# EAGLE design ds32 (EAGLE 6.6.0)
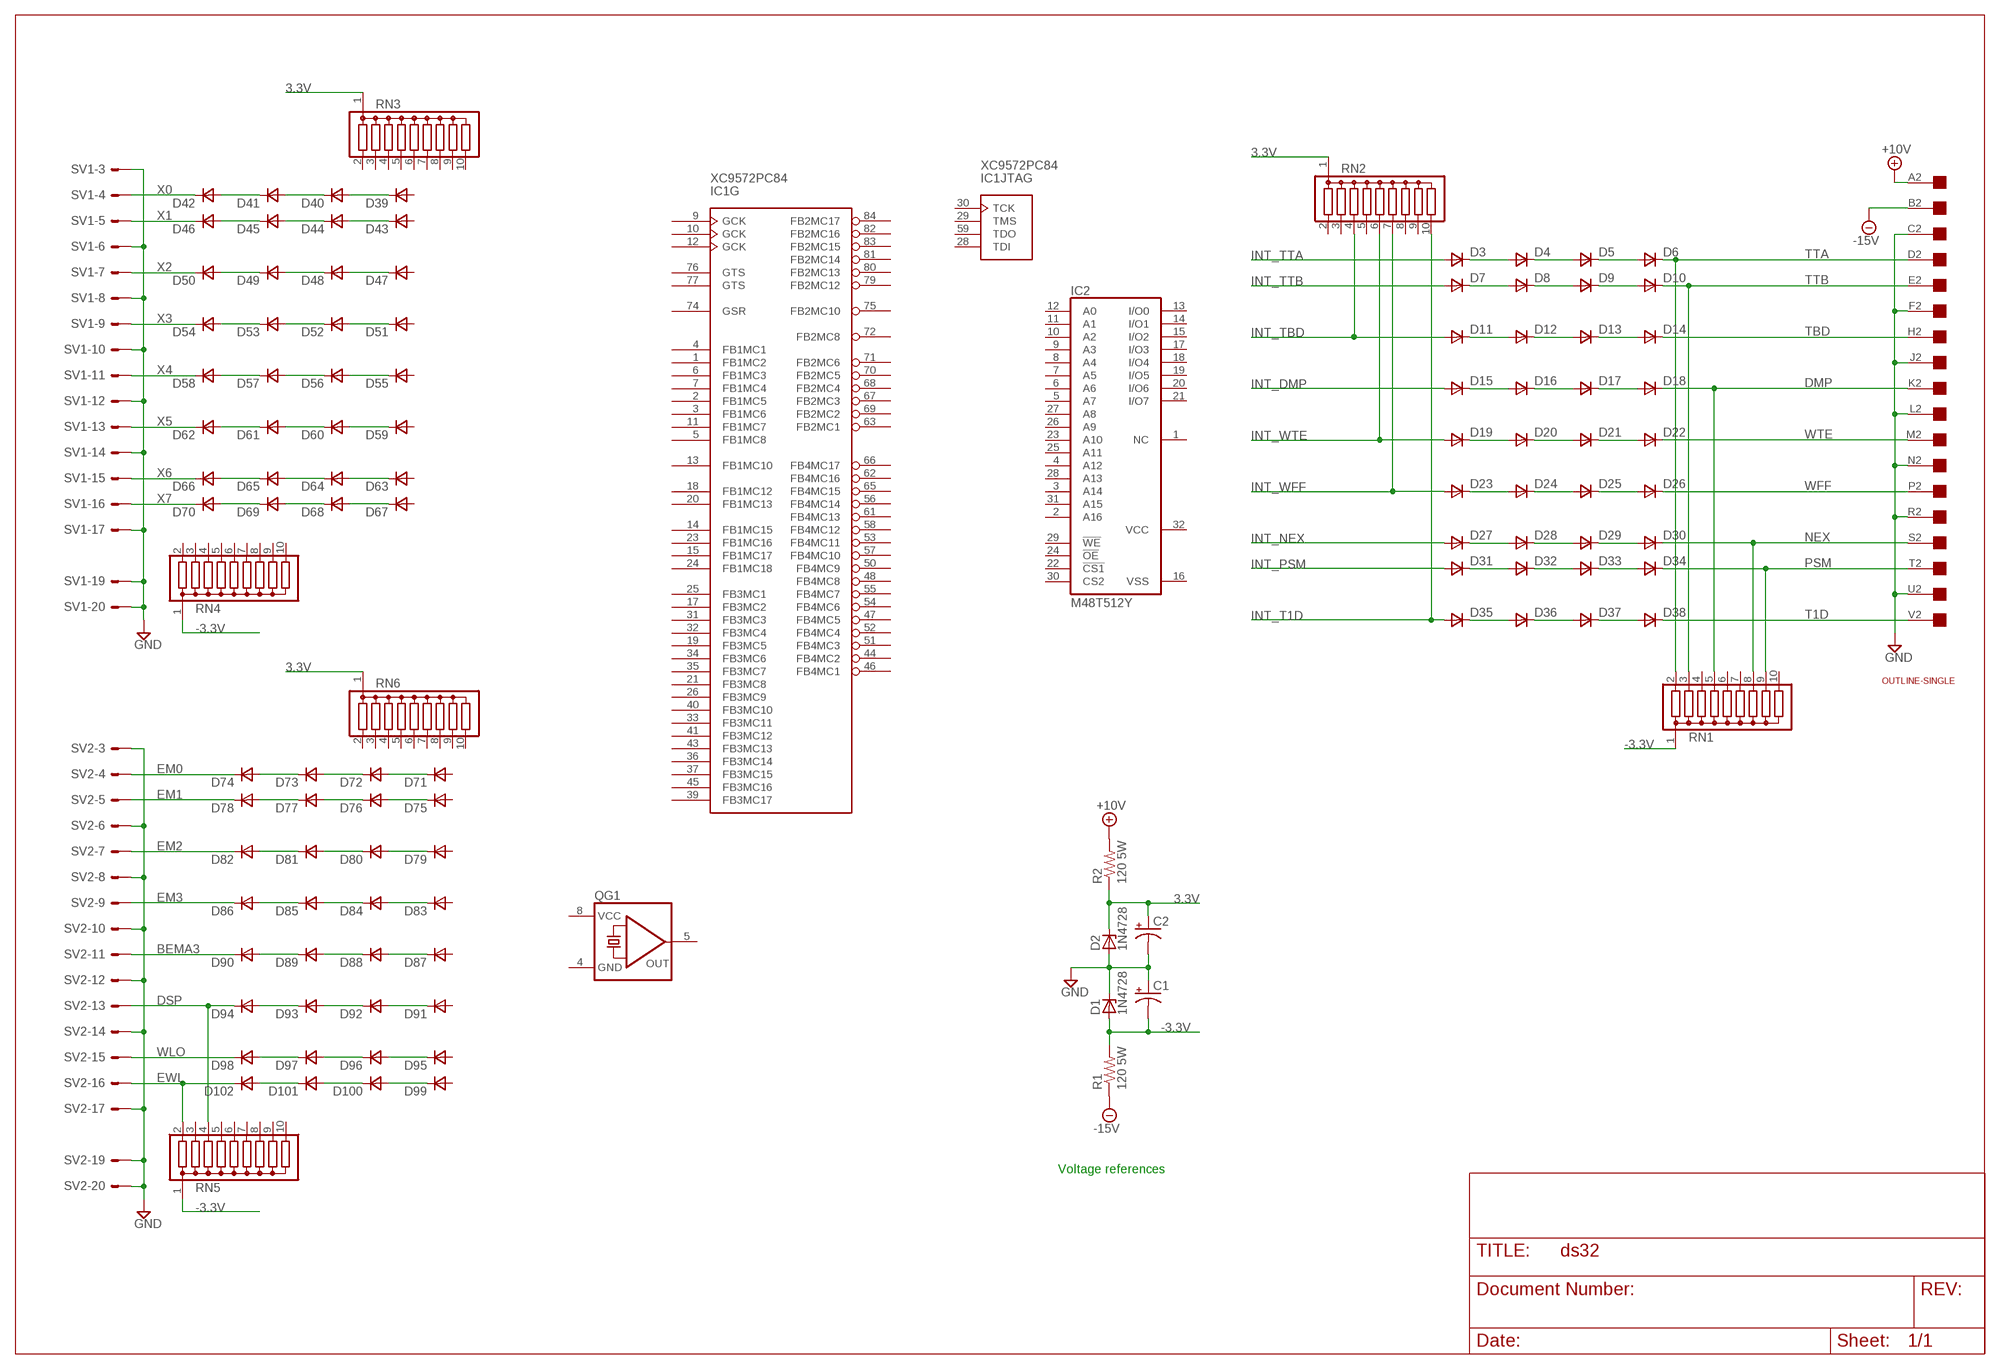
[diagram p0: schematic, sheet 1]

## Parts
C1  CPOL-USE15-5AXIAL  [E15-5]
C2  CPOL-USE15-5AXIAL  [E15-5]
D1  1N4728  [DO41Z10]
D2  1N4728  [DO41Z10]
D3  DSOD323  [SOD323]
D4  DSOD323  [SOD323]
D5  DSOD323  [SOD323]
D6  DSOD323  [SOD323]
D7  DSOD323  [SOD323]
D8  DSOD323  [SOD323]
D9  DSOD323  [SOD323]
D10  DSOD323  [SOD323]
D11  DSOD323  [SOD323]
D12  DSOD323  [SOD323]
D13  DSOD323  [SOD323]
D14  DSOD323  [SOD323]
D15  DSOD323  [SOD323]
D16  DSOD323  [SOD323]
D17  DSOD323  [SOD323]
D18  DSOD323  [SOD323]
D19  DSOD323  [SOD323]
D20  DSOD323  [SOD323]
D21  DSOD323  [SOD323]
D22  DSOD323  [SOD323]
D23  DSOD323  [SOD323]
D24  DSOD323  [SOD323]
D25  DSOD323  [SOD323]
D26  DSOD323  [SOD323]
D27  DSOD323  [SOD323]
D28  DSOD323  [SOD323]
D29  DSOD323  [SOD323]
D30  DSOD323  [SOD323]
D31  DSOD323  [SOD323]
D32  DSOD323  [SOD323]
D33  DSOD323  [SOD323]
D34  DSOD323  [SOD323]
D35  DSOD323  [SOD323]
D36  DSOD323  [SOD323]
D37  DSOD323  [SOD323]
D38  DSOD323  [SOD323]
D39  DSOD323  [SOD323]
D40  DSOD323  [SOD323]
D41  DSOD323  [SOD323]
D42  DSOD323  [SOD323]
D43  DSOD323  [SOD323]
D44  DSOD323  [SOD323]
D45  DSOD323  [SOD323]
D46  DSOD323  [SOD323]
D47  DSOD323  [SOD323]
D48  DSOD323  [SOD323]
D49  DSOD323  [SOD323]
D50  DSOD323  [SOD323]
D51  DSOD323  [SOD323]
D52  DSOD323  [SOD323]
D53  DSOD323  [SOD323]
D54  DSOD323  [SOD323]
D55  DSOD323  [SOD323]
D56  DSOD323  [SOD323]
D57  DSOD323  [SOD323]
D58  DSOD323  [SOD323]
D59  DSOD323  [SOD323]
D60  DSOD323  [SOD323]
D61  DSOD323  [SOD323]
D62  DSOD323  [SOD323]
D63  DSOD323  [SOD323]
D64  DSOD323  [SOD323]
D65  DSOD323  [SOD323]
D66  DSOD323  [SOD323]
D67  DSOD323  [SOD323]
D68  DSOD323  [SOD323]
D69  DSOD323  [SOD323]
D70  DSOD323  [SOD323]
D71  DSOD323  [SOD323]
D72  DSOD323  [SOD323]
D73  DSOD323  [SOD323]
D74  DSOD323  [SOD323]
D75  DSOD323  [SOD323]
D76  DSOD323  [SOD323]
D77  DSOD323  [SOD323]
D78  DSOD323  [SOD323]
D79  DSOD323  [SOD323]
D80  DSOD323  [SOD323]
D81  DSOD323  [SOD323]
D82  DSOD323  [SOD323]
D83  DSOD323  [SOD323]
D84  DSOD323  [SOD323]
D85  DSOD323  [SOD323]
D86  DSOD323  [SOD323]
D87  DSOD323  [SOD323]
D88  DSOD323  [SOD323]
D89  DSOD323  [SOD323]
D90  DSOD323  [SOD323]
D91  DSOD323  [SOD323]
D92  DSOD323  [SOD323]
D93  DSOD323  [SOD323]
D94  DSOD323  [SOD323]
D95  DSOD323  [SOD323]
D96  DSOD323  [SOD323]
D97  DSOD323  [SOD323]
D98  DSOD323  [SOD323]
D99  DSOD323  [SOD323]
D100  DSOD323  [SOD323]
D101  DSOD323  [SOD323]
D102  DSOD323  [SOD323]
IC1  XC9572PC84  [PLCC-S84]
IC2  M48T512Y  628128P  [DIL32]
QG1  QG5460  [DIL08S]
R1  120 5W  R-US_0411/15  [0411/15]
R2  120 5W  R-US_0411/15  [0411/15]
RN1  G09R  [SIL10]
RN2  G09R  [SIL10]
RN3  G09R  [SIL10]
RN4  G09R  [SIL10]
RN5  G09R  [SIL10]
RN6  G09R  [SIL10]
SV1  ML20E  [ML20]
SV2  ML20E  [ML20]
U$1  EDGE-1  [EDGE-CON1]
U$2  OUTLINE-SINGLE  [SINGLE]

## Nets
3.3V [power]: C2.+ D2.C R2.1 RN2.1 RN3.1 RN6.1
+10V [power]: R2.2 U$1.A2
-3.3V [power]: C1.- D1.A R1.2 RN1.1 RN4.1 RN5.1
-15V [power]: R1.1 U$1.B2
BEMA3: D90.1(C) SV2.11
DMP: D18.1(C) RN1.5 U$1.K2
DSP: D94.1(C) RN5.4 SV2.13
EM0: D74.1(C) SV2.4
EM1: D78.1(C) SV2.5
EM2: D82.1(C) SV2.7
EM3: D86.1(C) SV2.9
EWL: D102.1(C) RN5.2 SV2.16
GND [power]: C1.+ C2.- D1.C D2.A SV1.3 SV1.6 SV1.8 SV1.10 SV1.12 SV1.14 SV1.17 SV1.19 SV1.20 SV2.3 SV2.6 SV2.8 SV2.10 SV2.12 SV2.14 SV2.17 SV2.19 SV2.20 U$1.C2 U$1.F2 U$1.J2 U$1.L2 U$1.N2 U$1.R2 U$1.U2
INT_DMP: D15.2(A)
INT_NEX: D27.2(A)
INT_PSM: D31.2(A)
INT_T1D: D35.2(A) RN2.10
INT_TBD: D11.2(A) RN2.4
INT_TTA: D3.2(A)
INT_TTB: D7.2(A)
INT_WFF: D23.2(A) RN2.7
INT_WTE: D19.2(A) RN2.6
N$2: D13.1(C) D14.2(A)
N$3: D12.1(C) D13.2(A)
N$4: D11.1(C) D12.2(A)
N$5: D17.1(C) D18.2(A)
N$6: D9.1(C) D10.2(A)
N$7: D8.1(C) D9.2(A)
N$8: D7.1(C) D8.2(A)
N$9: D16.1(C) D17.2(A)
N$10: D15.1(C) D16.2(A)
N$11: D5.1(C) D6.2(A)
N$12: D4.1(C) D5.2(A)
N$13: D3.1(C) D4.2(A)
N$14: D21.1(C) D22.2(A)
N$15: D20.1(C) D21.2(A)
N$16: D19.1(C) D20.2(A)
N$17: D25.1(C) D26.2(A)
N$18: D24.1(C) D25.2(A)
N$19: D23.1(C) D24.2(A)
N$20: D29.1(C) D30.2(A)
N$21: D28.1(C) D29.2(A)
N$22: D27.1(C) D28.2(A)
N$23: D33.1(C) D34.2(A)
N$24: D32.1(C) D33.2(A)
N$25: D31.1(C) D32.2(A)
N$26: D37.1(C) D38.2(A)
N$27: D36.1(C) D37.2(A)
N$28: D35.1(C) D36.2(A)
N$29: D41.1(C) D42.2(A)
N$30: D40.1(C) D41.2(A)
N$31: D39.1(C) D40.2(A)
N$32: D45.1(C) D46.2(A)
N$33: D44.1(C) D45.2(A)
N$34: D43.1(C) D44.2(A)
N$35: D49.1(C) D50.2(A)
N$36: D48.1(C) D49.2(A)
N$37: D47.1(C) D48.2(A)
N$38: D53.1(C) D54.2(A)
N$39: D52.1(C) D53.2(A)
N$40: D51.1(C) D52.2(A)
N$41: D57.1(C) D58.2(A)
N$42: D56.1(C) D57.2(A)
N$43: D55.1(C) D56.2(A)
N$44: D61.1(C) D62.2(A)
N$45: D60.1(C) D61.2(A)
N$46: D59.1(C) D60.2(A)
N$47: D65.1(C) D66.2(A)
N$48: D64.1(C) D65.2(A)
N$49: D63.1(C) D64.2(A)
N$50: D69.1(C) D70.2(A)
N$51: D68.1(C) D69.2(A)
N$52: D67.1(C) D68.2(A)
N$53: D73.1(C) D74.2(A)
N$54: D72.1(C) D73.2(A)
N$55: D71.1(C) D72.2(A)
N$56: D77.1(C) D78.2(A)
N$57: D76.1(C) D77.2(A)
N$58: D75.1(C) D76.2(A)
N$59: D81.1(C) D82.2(A)
N$60: D80.1(C) D81.2(A)
N$61: D79.1(C) D80.2(A)
N$62: D85.1(C) D86.2(A)
N$63: D84.1(C) D85.2(A)
N$64: D83.1(C) D84.2(A)
N$65: D89.1(C) D90.2(A)
N$66: D88.1(C) D89.2(A)
N$67: D87.1(C) D88.2(A)
N$68: D93.1(C) D94.2(A)
N$69: D92.1(C) D93.2(A)
N$70: D91.1(C) D92.2(A)
N$71: D97.1(C) D98.2(A)
N$72: D96.1(C) D97.2(A)
N$73: D95.1(C) D96.2(A)
N$74: D101.1(C) D102.2(A)
N$75: D100.1(C) D101.2(A)
N$76: D99.1(C) D100.2(A)
NEX: D30.1(C) RN1.8 U$1.S2
PSM: D34.1(C) RN1.9 U$1.T2
T1D: D38.1(C) U$1.V2
TBD: D14.1(C) U$1.H2
TTA: D6.1(C) RN1.2 U$1.D2
TTB: D10.1(C) RN1.3 U$1.E2
WFF: D26.1(C) U$1.P2
WLO: D98.1(C) SV2.15
WTE: D22.1(C) U$1.M2
X0: D42.1(C) SV1.4
X1: D46.1(C) SV1.5
X2: D50.1(C) SV1.7
X3: D54.1(C) SV1.9
X4: D58.1(C) SV1.11
X5: D62.1(C) SV1.13
X6: D66.1(C) SV1.15
X7: D70.1(C) SV1.16
Unconnected: D39.2(A) D43.2(A) D47.2(A) D51.2(A) D55.2(A) D59.2(A) D63.2(A) D67.2(A) D71.2(A) D75.2(A) D79.2(A) D83.2(A) D87.2(A) D91.2(A) D95.2(A) D99.2(A) IC1.1(G:FB1MC2) IC1.2(G:FB1MC5) IC1.3(G:FB1MC6) IC1.4(G:FB1MC1) IC1.5(G:FB1MC8) IC1.6(G:FB1MC3) IC1.7(G:FB1MC4) IC1.9(G:GCK) IC1.10(G:GCK) IC1.11(G:FB1MC7) IC1.12(G:GCK) IC1.13(G:FB1MC10) IC1.14(G:FB1MC15) IC1.15(G:FB1MC17) IC1.17(G:FB3MC2) IC1.18(G:FB1MC12) IC1.19(G:FB3MC5) IC1.20(G:FB1MC13) IC1.21(G:FB3MC8) IC1.23(G:FB1MC16) IC1.24(G:FB1MC18) IC1.25(G:FB3MC1) IC1.26(G:FB3MC9) IC1.28(JTAG:TDI) IC1.29(JTAG:TMS) IC1.30(JTAG:TCK) IC1.31(G:FB3MC3) IC1.32(G:FB3MC4) IC1.33(G:FB3MC11) IC1.34(G:FB3MC6) IC1.35(G:FB3MC7) IC1.36(G:FB3MC14) IC1.37(G:FB3MC15) IC1.39(G:FB3MC17) IC1.40(G:FB3MC10) IC1.41(G:FB3MC12) IC1.43(G:FB3MC13) IC1.44(G:FB4MC2) IC1.45(G:FB3MC16) IC1.46(G:FB4MC1) IC1.47(G:FB4MC5) IC1.48(G:FB4MC8) IC1.50(G:FB4MC9) IC1.51(G:FB4MC3) IC1.52(G:FB4MC4) IC1.53(G:FB4MC11) IC1.54(G:FB4MC6) IC1.55(G:FB4MC7) IC1.56(G:FB4MC14) IC1.57(G:FB4MC10) IC1.58(G:FB4MC12) IC1.59(JTAG:TDO) IC1.61(G:FB4MC13) IC1.62(G:FB4MC16) IC1.63(G:FB2MC1) IC1.65(G:FB4MC15) IC1.66(G:FB4MC17) IC1.67(G:FB2MC3) IC1.68(G:FB2MC4) IC1.69(G:FB2MC2) IC1.70(G:FB2MC5) IC1.71(G:FB2MC6) IC1.72(G:FB2MC8) IC1.74(G:GSR) IC1.75(G:FB2MC10) IC1.76(G:GTS) IC1.77(G:GTS) IC1.79(G:FB2MC12) IC1.80(G:FB2MC13) IC1.81(G:FB2MC14) IC1.82(G:FB2MC16) IC1.83(G:FB2MC15) IC1.84(G:FB2MC17) IC2.1(NC) IC2.2(A16) IC2.3(A14) IC2.4(A12) IC2.5(A7) IC2.6(A6) IC2.7(A5) IC2.8(A4) IC2.9(A3) IC2.10(A2) IC2.11(A1) IC2.12(A0) IC2.13(I/O0) IC2.14(I/O1) IC2.15(I/O2) IC2.17(I/O3) IC2.18(I/O4) IC2.19(I/O5) IC2.20(I/O6) IC2.21(I/O7) IC2.22(!CS1) IC2.23(A10) IC2.24(!OE) IC2.25(A11) IC2.26(A9) IC2.27(A8) IC2.28(A13) IC2.29(!WE) IC2.30(CS2) IC2.31(A15) QG1.5(OUT) RN1.4 RN1.6 RN1.7 RN1.10 RN2.2 RN2.3 RN2.5 RN2.8 RN2.9 RN3.2 RN3.3 RN3.4 RN3.5 RN3.6 RN3.7 RN3.8 RN3.9 RN3.10 RN4.2 RN4.3 RN4.4 RN4.5 RN4.6 RN4.7 RN4.8 RN4.9 RN4.10 RN5.3 RN5.5 RN5.6 RN5.7 RN5.8 RN5.9 RN5.10 RN6.2 RN6.3 RN6.4 RN6.5 RN6.6 RN6.7 RN6.8 RN6.9 RN6.10 SV1.1 SV1.2 SV1.18 SV2.1 SV2.2 SV2.18

## Notes on the sheet
- Voltage references

## Power pins joined to a net without a drawn wire
GND: IC1.8(P:GND) IC1.16(P:GND) IC1.27(P:GND) IC1.42(P:GND) IC1.49(P:GND) IC1.60(P:GND) QG1.4(GND)
VCC: IC1.22(P:VCC) IC1.38(P:VCC) IC1.64(P:VCC) IC1.73(P:VCC) IC1.78(P:VCC) IC2.32(VCC) QG1.8(VCC)
VSS: IC2.16(VSS)

## Library data of the parts
C1 C2 = rcl:CPOL-US: POLARIZED CAPACITOR, American symbol
D1 D2 = diode:1N4728: Z DIODE 3.3 V, 1W, 5 percent
D3-D102 = zetex:D: DIODE; MPN: CDSOD323-T05C; OC_FARNELL: 1824860; OC_NEWARK: 79R6078
IC1 = xl_cpld:XC9572PC84
IC2 = memory-hitachi:628128P: MEMORY; OC_FARNELL: unknown; OC_NEWARK: unknown
QG1 = crystal:QG5460: CRYSTAL RESONATOR; OC_FARNELL: unknown; OC_NEWARK: unknown
R1 R2 = rcl:R-US_: RESISTOR, American symbol
RN1-RN6 = resistor-sil:G09R: SIL RESISTOR; OC_FARNELL: unknown; OC_NEWARK: unknown
SV1 SV2 = con-harting-ml:ML20?E: HARTING; OC_FARNELL: unknown; OC_NEWARK: unknown
U$1 = dec-con:EDGE-1: Single-Sided DEC Edge Connector -- (side 2)
U$2 = dec-con:OUTLINE-*: Board outlines for DEC boards.

## Net classes
1 power: width 0.508 mm

## Board
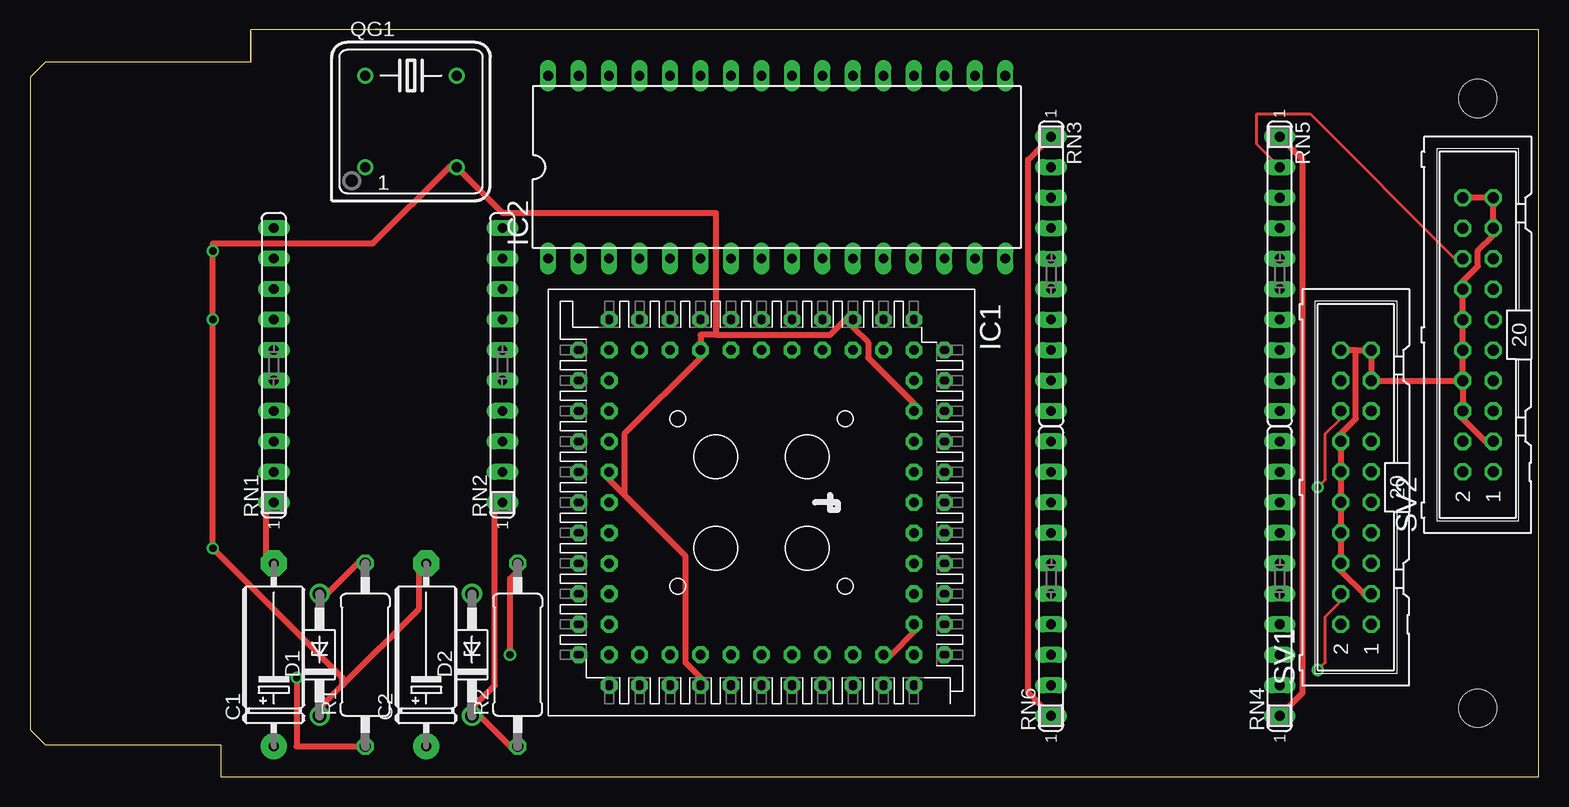
[diagram p1: board, top side]
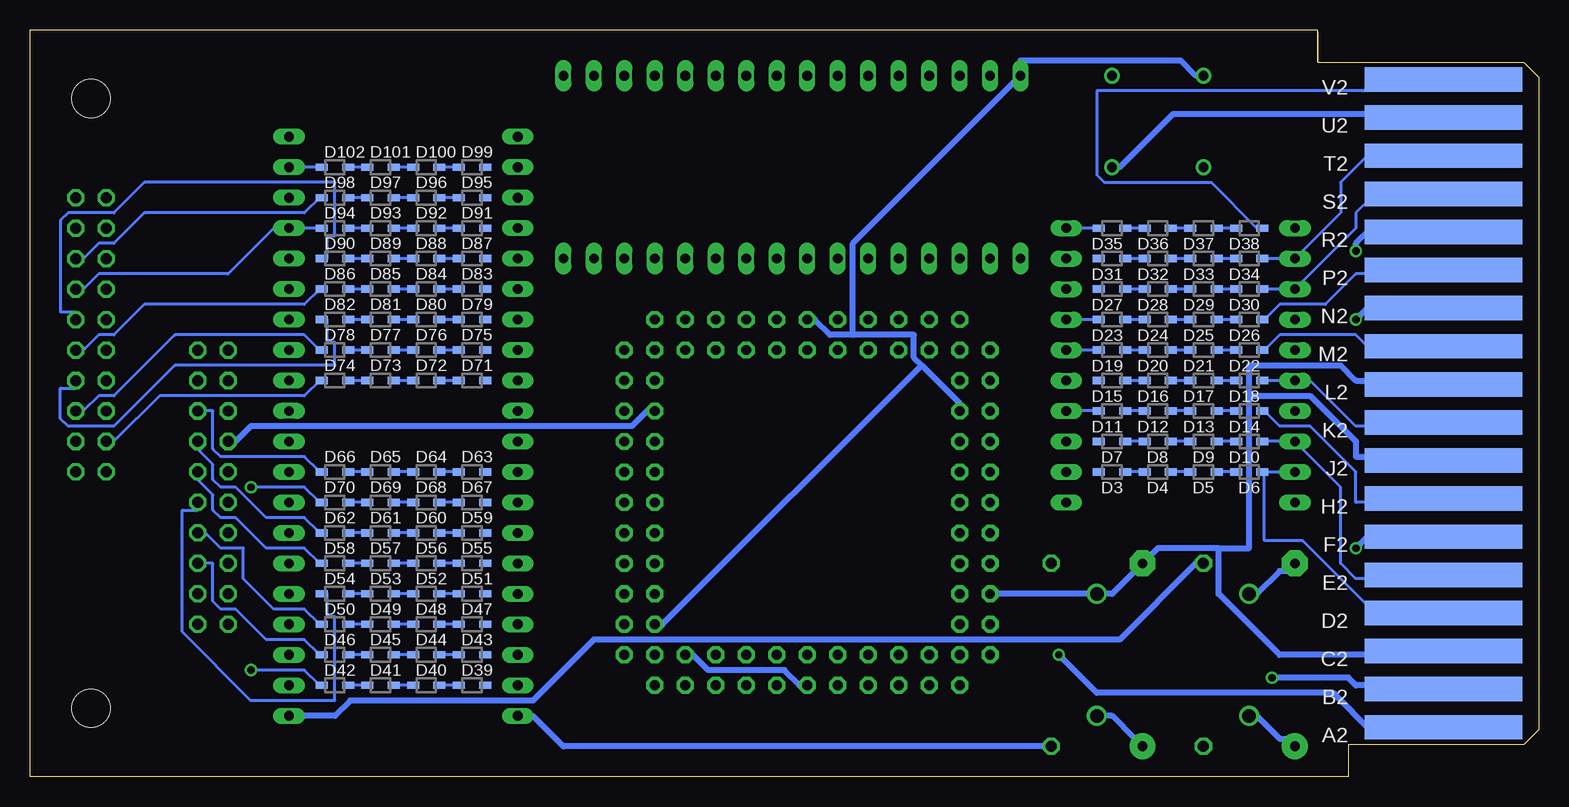
[diagram p2: board, bottom side, seen from below]

Size 125.73 x 62.23 mm. Coordinates in mm from the lower left corner, seen from the top.
Copper layers (1*16): Top 0.035mm / dielectric 1.5mm / Bottom 0.035mm
Design rules "8mils *": minimum track width 10mil, minimum drill 24mil, track to track 8mil, track to pad 8mil, pad to pad 8mil, via to via 8mil, smd to smd 8mil, copper to edge 15mil, drill to drill 10mil, minimum pad ring 10mil, minimum via ring 8mil, stop-mask expansion 0mil, vias tented up to drill 0mil, thermal gap 10mil

### Footprints (pad centres in the part's own frame; a part is rotated, then mirrored left to right if it is on the bottom)
E15-5 = drill 0.813 pad 2.159: + -7.62,0 | drill 0.813 pad 2.159 octagon: - 7.62,0
DO41Z10 = drill 1.118: A 5.08,0; C -5.08,0
SOD323 = smd 1 x 0.6: 1 -1.1,0; 2 1.1,0
PLCC-S84 = drill 0.813 pad 1.397 octagon: 1 0,15.24; 2 0,12.7; 3 -2.54,15.24; 4 -2.54,12.7; 5 -5.08,15.24; 6 -5.08,12.7; 7 -7.62,15.24; 8 -7.62,12.7; 9 -10.16,15.24; 10 -10.16,12.7; 11 -12.7,15.24; 12 -15.24,12.7; 13 -12.7,12.7; 14 -15.24,10.16; 15 -12.7,10.16; 16 -15.24,7.62; 17 -12.7,7.62; 18 -15.24,5.08; 19 -12.7,5.08; 20 -15.24,2.54; 21 -12.7,2.54; 22 -15.24,0; 23 -12.7,0; 24 -15.24,-2.54; 25 -12.7,-2.54; 26 -15.24,-5.08; 27 -12.7,-5.08; 28 -15.24,-7.62; 29 -12.7,-7.62; 30 -15.24,-10.16; 31 -12.7,-10.16; 32 -15.24,-12.7; 33 -12.7,-15.24; 34 -12.7,-12.7; 35 -10.16,-15.24; 36 -10.16,-12.7; 37 -7.62,-15.24; 38 -7.62,-12.7; 39 -5.08,-15.24; 40 -5.08,-12.7; 41 -2.54,-15.24; 42 -2.54,-12.7; 43 0,-15.24; 44 0,-12.7; 45 2.54,-15.24; 46 2.54,-12.7; 47 5.08,-15.24; 48 5.08,-12.7; 49 7.62,-15.24; 50 7.62,-12.7; 51 10.16,-15.24; 52 10.16,-12.7; 53 12.7,-15.24; 54 15.24,-12.7; 55 12.7,-12.7; 56 15.24,-10.16; 57 12.7,-10.16; 58 15.24,-7.62; 59 12.7,-7.62; 60 15.24,-5.08; 61 12.7,-5.08; 62 15.24,-2.54; 63 12.7,-2.54; 64 15.24,0; 65 12.7,0; 66 15.24,2.54; 67 12.7,2.54; 68 15.24,5.08; 69 12.7,5.08; 70 15.24,7.62; 71 12.7,7.62; 72 15.24,10.16; 73 12.7,10.16; 74 15.24,12.7; 75 12.7,15.24; 76 12.7,12.7; 77 10.16,15.24; 78 10.16,12.7; 79 7.62,15.24; 80 7.62,12.7; 81 5.08,15.24; 82 5.08,12.7; 83 2.54,15.24; 84 2.54,12.7
DIL32 = drill 0.813 long: 1 -19.05,-7.62; 2 -16.51,-7.62; 3 -13.97,-7.62; 4 -11.43,-7.62; 5 -8.89,-7.62; 6 -6.35,-7.62; 7 -3.81,-7.62; 8 -1.27,-7.62; 9 1.27,-7.62; 10 3.81,-7.62; 11 6.35,-7.62; 12 8.89,-7.62; 13 11.43,-7.62; 14 13.97,-7.62; 15 16.51,-7.62; 16 19.05,-7.62; 17 19.05,7.62; 18 16.51,7.62; 19 13.97,7.62; 20 11.43,7.62; 21 8.89,7.62; 22 6.35,7.62; 23 3.81,7.62; 24 1.27,7.62; 25 -1.27,7.62; 26 -3.81,7.62; 27 -6.35,7.62; 28 -8.89,7.62; 29 -11.43,7.62; 30 -13.97,7.62; 31 -16.51,7.62; 32 -19.05,7.62
DIL08S = drill 0.813: 1 -3.81,-3.81; 4 3.81,-3.81; 5 3.81,3.81; 8 -3.81,3.81
0411/15 = drill 0.914 octagon: 1 -7.62,0; 2 7.62,0
SIL10 = drill 0.813 long: 1 -11.43,0; 2 -8.89,0; 3 -6.35,0; 4 -3.81,0; 5 -1.27,0; 6 1.27,0; 7 3.81,0; 8 6.35,0; 9 8.89,0; 10 11.43,0
ML20 = drill 0.914 octagon: 1 -11.43,-1.27; 2 -11.43,1.27; 3 -8.89,-1.27; 4 -8.89,1.27; 5 -6.35,-1.27; 6 -6.35,1.27; 7 -3.81,-1.27; 8 -3.81,1.27; 9 -1.27,-1.27; 10 -1.27,1.27; 11 1.27,-1.27; 12 1.27,1.27; 13 3.81,-1.27; 14 3.81,1.27; 15 6.35,-1.27; 16 6.35,1.27; 17 8.89,-1.27; 18 8.89,1.27; 19 11.43,-1.27; 20 11.43,1.27
EDGE-CON1 = smd 13.106 x 2.032 bottom: A2 7.938,4.128; B2 7.938,7.303; C2 7.938,10.477; D2 7.938,13.652; E2 7.938,16.828; F2 7.938,20.003; H2 7.938,23.177; J2 7.938,26.352; K2 7.938,29.527; L2 7.938,32.703; M2 7.938,35.877; N2 7.938,39.053; P2 7.938,42.227; R2 7.938,45.403; S2 7.938,48.578; T2 7.938,51.752; U2 7.938,54.928; V2 7.938,58.102
SINGLE = hole 3.175: 120.65,56.515; 120.65,5.715

### Placement (x,y rotation side)
C1  20.32,10.16 90 top
C2  33.02,10.16 90 top
D1  24.13,10.16 90 top
D2  36.83,10.16 90 top
D3  35.56,25.4 180 bottom
D4  31.75,25.4 180 bottom
D5  27.94,25.4 180 bottom
D6  24.13,25.4 180 bottom
D7  35.56,27.94 180 bottom
D8  31.75,27.94 180 bottom
D9  27.94,27.94 180 bottom
D10  24.13,27.94 180 bottom
D11  35.56,30.48 180 bottom
D12  31.75,30.48 180 bottom
D13  27.94,30.48 180 bottom
D14  24.13,30.48 180 bottom
D15  35.56,33.02 180 bottom
D16  31.75,33.02 180 bottom
D17  27.94,33.02 180 bottom
D18  24.13,33.02 180 bottom
D19  35.56,35.56 180 bottom
D20  31.75,35.56 180 bottom
D21  27.94,35.56 180 bottom
D22  24.13,35.56 180 bottom
D23  35.56,38.1 180 bottom
D24  31.75,38.1 180 bottom
D25  27.94,38.1 180 bottom
D26  24.13,38.1 180 bottom
D27  35.56,40.64 180 bottom
D28  31.75,40.64 180 bottom
D29  27.94,40.64 180 bottom
D30  24.13,40.64 180 bottom
D31  35.56,43.18 180 bottom
D32  31.75,43.18 180 bottom
D33  27.94,43.18 180 bottom
D34  24.13,43.18 180 bottom
D35  35.56,45.72 180 bottom
D36  31.75,45.72 180 bottom
D37  27.94,45.72 180 bottom
D38  24.13,45.72 180 bottom
D39  88.9,7.62 0 bottom
D40  92.71,7.62 0 bottom
D41  96.52,7.62 0 bottom
D42  100.33,7.62 0 bottom
D43  88.9,10.16 0 bottom
D44  92.71,10.16 0 bottom
D45  96.52,10.16 0 bottom
D46  100.33,10.16 0 bottom
D47  88.9,12.7 0 bottom
D48  92.71,12.7 0 bottom
D49  96.52,12.7 0 bottom
D50  100.33,12.7 0 bottom
D51  88.9,15.24 0 bottom
D52  92.71,15.24 0 bottom
D53  96.52,15.24 0 bottom
D54  100.33,15.24 0 bottom
D55  88.9,17.78 0 bottom
D56  92.71,17.78 0 bottom
D57  96.52,17.78 0 bottom
D58  100.33,17.78 0 bottom
D59  88.9,20.32 0 bottom
D60  92.71,20.32 0 bottom
D61  96.52,20.32 0 bottom
D62  100.33,20.32 0 bottom
D63  88.9,25.4 0 bottom
D64  92.71,25.4 0 bottom
D65  96.52,25.4 0 bottom
D66  100.33,25.4 0 bottom
D67  88.9,22.86 0 bottom
D68  92.71,22.86 0 bottom
D69  96.52,22.86 0 bottom
D70  100.33,22.86 0 bottom
D71  88.9,33.02 0 bottom
D72  92.71,33.02 0 bottom
D73  96.52,33.02 0 bottom
D74  100.33,33.02 0 bottom
D75  88.9,35.56 0 bottom
D76  92.71,35.56 0 bottom
D77  96.52,35.56 0 bottom
D78  100.33,35.56 0 bottom
D79  88.9,38.1 0 bottom
D80  92.71,38.1 0 bottom
D81  96.52,38.1 0 bottom
D82  100.33,38.1 0 bottom
D83  88.9,40.64 0 bottom
D84  92.71,40.64 0 bottom
D85  96.52,40.64 0 bottom
D86  100.33,40.64 0 bottom
D87  88.9,43.18 0 bottom
D88  92.71,43.18 0 bottom
D89  96.52,43.18 0 bottom
D90  100.33,43.18 0 bottom
D91  88.9,45.72 0 bottom
D92  92.71,45.72 0 bottom
D93  96.52,45.72 0 bottom
D94  100.33,45.72 0 bottom
D95  88.9,48.26 0 bottom
D96  92.71,48.26 0 bottom
D97  96.52,48.26 0 bottom
D98  100.33,48.26 0 bottom
D99  88.9,50.8 0 bottom
D100  92.71,50.8 0 bottom
D101  96.52,50.8 0 bottom
D102  100.33,50.8 0 bottom
IC1  60.96,22.86 270 top
IC2  62.23,50.8 0 top
QG1  31.75,54.61 0 top
R1  27.94,10.16 90 top
R2  40.64,10.16 90 top
RN1  20.32,34.29 90 top
RN2  39.37,34.29 90 top
RN3  85.09,41.91 270 top
RN4  104.14,16.51 90 top
RN5  104.14,41.91 270 top
RN6  85.09,16.51 90 top
SV1  110.49,24.13 90 top
SV2  120.65,36.83 90 top
U$1  0,0 0 top
U$2  0,0 0 top

### Tracks (layer width: path | path; a pad name or v marks a point on that pad's centre or on a via)
3.3V
  Top 0.508: RN2.1 38.74,22.23 38.74,7.62 36.83,5.71 D2.C 37.47,5.08 40.01,2.54 R2.1 | RN3.1 84.46,52.7 83.19,51.44 83.19,6.99 84.46,5.71 RN6.1
  Bottom 0.508: C2.+ 33.66,3.17 35.56,5.08 36.2,5.08 D2.C | RN6.1 83.82,5.08 81.28,2.54 41.28,2.54 R2.1
+10V  (via drill 0.61)
  Top 0.508: v40.01,10.16 40.01,16.51 40.64,17.14 R2.2
  Bottom 0.508: v40.01,10.16 36.83,6.99 17.15,6.99 13.97,3.81 U$1.A2
-3.3V
  Top 0.508: R1.2 27.31,17.78 24.77,15.24 D1.A | RN1.1 19.69,22.23 19.69,18.41 C1.- | RN4.1 104.78,5.71 106.05,6.99 106.05,51.44 104.78,52.7 RN5.1
  Bottom 0.508: D1.A 23.5,15.24 21.59,17.14 20.96,17.14 C1.- | R1.2 28.58,17.78 34.93,11.43 78.74,11.43 83.82,6.35 99.06,6.35 100.33,5.08 102.87,5.08 RN4.1
-15V  (via drill 0.61)
  Top 0.508: R1.1 22.23,2.54 v22.23,8.26
  Bottom 0.508: v22.23,8.26 15.88,8.26 15.24,7.62 13.97,7.62 U$1.B2
BEMA3
  Bottom 0.254: D90.1 100.97,43.18 100.97,45.09 100.33,45.09 100.33,49.53 116.21,49.53 118.75,46.99 122.56,46.99 123.19,46.35 123.19,38.73 121.92,38.73 SV2.11
DMP
  Bottom 0.254: D18.1 RN1.5 19.05,33.02 15.24,29.21 12.7,29.21 U$1.K2
DSP
  Bottom 0.254: D94.1 101.6,45.72 102.87,45.72 RN5.4 105.41,45.72 109.22,41.91 120.02,41.91 121.29,40.64 SV2.13
EM0
  Bottom 0.254: D74.1 101.6,33.02 102.87,31.75 114.94,31.75 118.75,27.94 SV2.4
EM1
  Bottom 0.254: D78.1 101.6,35.56 102.87,36.83 113.67,36.83 118.75,31.75 120.02,31.75 121.29,30.48 SV2.5
EM2
  Bottom 0.254: D82.1 100.97,38.1 100.97,36.2 100.33,36.2 100.33,34.29 113.67,34.29 118.75,29.21 122.56,29.21 123.19,29.84 123.19,32.38 121.92,32.38 SV2.7
EM3
  Bottom 0.254: D86.1 101.6,40.64 102.87,39.37 116.21,39.37 118.75,36.83 120.02,36.83 121.29,35.56 SV2.9
EWL
  Top 0.254: SV2.16 118.75,43.18 106.68,55.24 102.24,55.24 102.24,52.7 103.51,51.44 RN5.2
  Bottom 0.254: D102.1 101.6,50.8 102.87,50.8 RN5.2
GND  (via drill 0.61)
  Top 0.508: 26.04,7.62 32.39,13.97 32.39,17.14 C2.- | 26.04,7.62 24.13,5.71 D1.C | 26.04,7.62 26.04,8.26 v15.24,19.05 v15.24,38.1 v15.24,43.81 15.24,44.45 28.58,44.45 34.93,50.8 QG1.4 39.37,46.99 57.15,46.99 57.15,36.83 | SV1.3 111.13,15.24 109.22,17.14 SV1.6 SV1.8 SV1.10 SV1.12 SV1.14 109.22,28.57 110.49,29.84 110.49,35.56 | SV2.20 SV2.19 SV2.17 121.92,45.09 120.65,43.81 120.65,42.55 119.38,41.27 SV2.14 SV2.12 SV2.10 SV2.8 | 110.49,35.56 SV1.20 | 110.49,35.56 SV1.19 SV1.17 SV2.8 | SV2.8 SV2.6 119.38,29.84 121.29,27.94 SV2.3 | IC1.8 73.66,31.11 69.85,34.92 69.85,36.2 68.58,37.47 IC1.16 67.95,38.1 66.68,36.83 57.15,36.83 | 49.53,23.5 48.26,24.77 IC1.42 | 49.53,23.5 54.61,18.41 54.61,9.53 55.88,8.26 IC1.60 | 49.53,23.5 49.53,28.57 55.88,34.92 IC1.27 55.88,36.83 57.15,36.83
  Bottom 0.508: QG1.4 34.93,50.8 30.48,55.24 12.7,55.24 U$1.U2 | D1.C 23.5,5.08 21.59,3.17 20.96,3.17 C1.+ | IC1.49 D2.A 35.56,15.24 C2.- 31.75,19.05 26.67,19.05 | 26.67,19.05 26.67,15.24 21.59,10.16 13.97,10.16 U$1.C2 | v15.24,19.05 13.97,20.32 U$1.F2 | 24.13,31.75 19.05,31.75 15.24,27.94 15.24,26.67 13.97,26.67 U$1.J2 | 24.13,31.75 24.13,19.05 26.67,19.05 | 24.13,31.75 24.13,34.29 16.51,34.29 15.24,33.02 13.97,33.02 U$1.L2 | v15.24,38.1 13.97,39.37 U$1.N2 | v15.24,43.81 15.24,44.45 13.97,45.72 U$1.R2 | SV1.14 108.59,27.94 107.32,29.21 75.57,29.21 74.3,30.48 IC1.8
INT_T1D
  Bottom 0.254: D35.2 36.83,45.72 38.1,45.72 RN2.10
INT_TBD
  Bottom 0.254: D11.2 36.83,30.48 38.1,30.48 RN2.4
INT_WFF
  Bottom 0.254: D23.2 36.83,38.1 38.1,38.1 RN2.7
INT_WTE
  Bottom 0.254: D19.2 36.83,35.56 38.1,35.56 RN2.6
N$2
  Bottom 0.254: D14.2 25.4,30.48 26.67,30.48 D13.1
N$3
  Bottom 0.254: D13.2 29.21,30.48 30.48,30.48 D12.1
N$4
  Bottom 0.254: D12.2 33.02,30.48 34.29,30.48 D11.1
N$5
  Bottom 0.254: D18.2 25.4,33.02 26.67,33.02 D17.1
N$6
  Bottom 0.254: D10.2 25.4,27.94 26.67,27.94 D9.1
N$7
  Bottom 0.254: D9.2 29.21,27.94 30.48,27.94 D8.1
N$8
  Bottom 0.254: D8.2 33.02,27.94 34.29,27.94 D7.1
N$9
  Bottom 0.254: D17.2 29.21,33.02 30.48,33.02 D16.1
N$10
  Bottom 0.254: D16.2 33.02,33.02 34.29,33.02 D15.1
N$11
  Bottom 0.254: D6.2 25.4,25.4 26.67,25.4 D5.1
N$12
  Bottom 0.254: D5.2 29.21,25.4 30.48,25.4 D4.1
N$13
  Bottom 0.254: D4.2 33.02,25.4 34.29,25.4 D3.1
N$14
  Bottom 0.254: D22.2 25.4,35.56 26.67,35.56 D21.1
N$15
  Bottom 0.254: D21.2 29.21,35.56 30.48,35.56 D20.1
N$16
  Bottom 0.254: D20.2 33.02,35.56 34.29,35.56 D19.1
N$17
  Bottom 0.254: D26.2 25.4,38.1 26.67,38.1 D25.1
N$18
  Bottom 0.254: D25.2 29.21,38.1 30.48,38.1 D24.1
N$19
  Bottom 0.254: D24.2 33.02,38.1 34.29,38.1 D23.1
N$20
  Bottom 0.254: D30.2 25.4,40.64 26.67,40.64 D29.1
N$21
  Bottom 0.254: D29.2 29.21,40.64 30.48,40.64 D28.1
N$22
  Bottom 0.254: D28.2 33.02,40.64 34.29,40.64 D27.1
N$23
  Bottom 0.254: D34.2 25.4,43.18 26.67,43.18 D33.1
N$24
  Bottom 0.254: D33.2 29.21,43.18 30.48,43.18 D32.1
N$25
  Bottom 0.254: D32.2 33.02,43.18 34.29,43.18 D31.1
N$26
  Bottom 0.254: D38.2 25.4,45.72 26.67,45.72 D37.1
N$27
  Bottom 0.254: D37.2 29.21,45.72 30.48,45.72 D36.1
N$28
  Bottom 0.254: D36.2 33.02,45.72 34.29,45.72 D35.1
N$29
  Bottom 0.254: D41.1 97.79,7.62 99.06,7.62 D42.2
N$30
  Bottom 0.254: D40.1 93.98,7.62 95.25,7.62 D41.2
N$31
  Bottom 0.254: D39.1 90.17,7.62 91.44,7.62 D40.2
N$32
  Bottom 0.254: D45.1 97.79,10.16 99.06,10.16 D46.2
N$33
  Bottom 0.254: D44.1 93.98,10.16 95.25,10.16 D45.2
N$34
  Bottom 0.254: D43.1 90.17,10.16 91.44,10.16 D44.2
N$35
  Bottom 0.254: D49.1 97.79,12.7 99.06,12.7 D50.2
N$36
  Bottom 0.254: D48.1 93.98,12.7 95.25,12.7 D49.2
N$37
  Bottom 0.254: D47.1 90.17,12.7 91.44,12.7 D48.2
N$38
  Bottom 0.254: D53.1 97.79,15.24 99.06,15.24 D54.2
N$39
  Bottom 0.254: D52.1 93.98,15.24 95.25,15.24 D53.2
N$40
  Bottom 0.254: D51.1 90.17,15.24 91.44,15.24 D52.2
N$41
  Bottom 0.254: D57.1 97.79,17.78 99.06,17.78 D58.2
N$42
  Bottom 0.254: D56.1 93.98,17.78 95.25,17.78 D57.2
N$43
  Bottom 0.254: D55.1 90.17,17.78 91.44,17.78 D56.2
N$44
  Bottom 0.254: D61.1 97.79,20.32 99.06,20.32 D62.2
N$45
  Bottom 0.254: D60.1 93.98,20.32 95.25,20.32 D61.2
N$46
  Bottom 0.254: D59.1 90.17,20.32 91.44,20.32 D60.2
N$47
  Bottom 0.254: D65.1 97.79,25.4 99.06,25.4 D66.2
N$48
  Bottom 0.254: D64.1 93.98,25.4 95.25,25.4 D65.2
N$49
  Bottom 0.254: D63.1 90.17,25.4 91.44,25.4 D64.2
N$50
  Bottom 0.254: D69.1 97.79,22.86 99.06,22.86 D70.2
N$51
  Bottom 0.254: D68.1 93.98,22.86 95.25,22.86 D69.2
N$52
  Bottom 0.254: D67.1 90.17,22.86 91.44,22.86 D68.2
N$53
  Bottom 0.254: D73.1 97.79,33.02 99.06,33.02 D74.2
N$54
  Bottom 0.254: D72.1 93.98,33.02 95.25,33.02 D73.2
N$55
  Bottom 0.254: D71.1 90.17,33.02 91.44,33.02 D72.2
N$56
  Bottom 0.254: D77.1 97.79,35.56 99.06,35.56 D78.2
N$57
  Bottom 0.254: D76.1 93.98,35.56 95.25,35.56 D77.2
N$58
  Bottom 0.254: D75.1 90.17,35.56 91.44,35.56 D76.2
N$59
  Bottom 0.254: D81.1 97.79,38.1 99.06,38.1 D82.2
N$60
  Bottom 0.254: D80.1 93.98,38.1 95.25,38.1 D81.2
N$61
  Bottom 0.254: D79.1 90.17,38.1 91.44,38.1 D80.2
N$62
  Bottom 0.254: D85.1 97.79,40.64 99.06,40.64 D86.2
N$63
  Bottom 0.254: D84.1 93.98,40.64 95.25,40.64 D85.2
N$64
  Bottom 0.254: D83.1 90.17,40.64 91.44,40.64 D84.2
N$65
  Bottom 0.254: D89.1 97.79,43.18 99.06,43.18 D90.2
N$66
  Bottom 0.254: D88.1 93.98,43.18 95.25,43.18 D89.2
N$67
  Bottom 0.254: D87.1 90.17,43.18 91.44,43.18 D88.2
N$68
  Bottom 0.254: D93.1 97.79,45.72 99.06,45.72 D94.2
N$69
  Bottom 0.254: D92.1 93.98,45.72 95.25,45.72 D93.2
N$70
  Bottom 0.254: D91.1 90.17,45.72 91.44,45.72 D92.2
N$71
  Bottom 0.254: D97.1 97.79,48.26 99.06,48.26 D98.2
N$72
  Bottom 0.254: D96.1 93.98,48.26 95.25,48.26 D97.2
N$73
  Bottom 0.254: D95.1 90.17,48.26 91.44,48.26 D96.2
N$74
  Bottom 0.254: D101.1 97.79,50.8 99.06,50.8 D102.2
N$75
  Bottom 0.254: D100.1 93.98,50.8 95.25,50.8 D101.2
N$76
  Bottom 0.254: D99.1 90.17,50.8 91.44,50.8 D100.2
NEX
  Bottom 0.254: D30.1 RN1.8 15.24,45.72 15.24,46.99 13.97,48.26 U$1.S2
PSM
  Bottom 0.254: D34.1 RN1.9 16.51,46.99 16.51,49.53 13.97,52.07 U$1.T2
T1D
  Bottom 0.254: D38.1 23.5,45.72 27.31,49.53 36.2,49.53 36.83,50.16 36.83,57.15 14.61,57.15 13.97,57.78 U$1.V2
TBD
  Bottom 0.254: D14.1 22.86,30.48 21.59,29.21 19.05,29.21 15.24,25.4 15.24,22.86 13.97,22.86 U$1.H2
TTA
  Bottom 0.254: 22.86,25.4 RN1.2 | 22.86,25.4 22.86,19.68 19.69,19.68 13.97,13.97 U$1.D2 | 22.86,25.4 D6.1
TTB
  Bottom 0.254: D10.1 RN1.3 16.51,24.13 16.51,17.78 15.24,16.51 13.97,16.51 U$1.E2
VCC
  Top 0.508: IC1.78 73.66,12.06 71.76,10.16 IC1.73
  Bottom 0.508: IC1.64 61.6,7.62 62.87,8.89 69.22,8.89 70.49,10.16 IC1.73 | QG1.8 28.58,58.42 29.85,59.69 43.18,59.69 IC2.32 43.82,57.78 57.15,44.45 57.15,36.83 | 51.44,34.29 52.07,34.92 52.07,36.83 57.15,36.83 | 51.44,34.29 48.26,31.11 IC1.38 | 57.15,36.83 59.06,36.83 60.33,38.1 IC1.22 | 51.44,34.29 73.03,12.7 IC1.78
WFF
  Bottom 0.254: D26.1 22.86,38.1 21.59,39.37 17.78,39.37 15.24,41.91 13.97,41.91 U$1.P2
WLO
  Bottom 0.254: D98.1 101.6,48.26 102.87,46.99 116.21,46.99 118.75,44.45 120.02,44.45 121.29,43.18 SV2.15
WTE
  Bottom 0.254: D22.1 22.86,35.56 21.59,36.83 15.24,36.83 13.97,35.56 U$1.M2
X0  (via drill 0.61)
  Top 0.254: v107.32,8.89 107.95,9.53 107.95,13.34 109.22,14.61 SV1.4
  Bottom 0.254: v107.32,8.89 102.87,8.89 101.6,7.62 D42.1
X1
  Bottom 0.254: D46.1 101.6,10.16 102.87,11.43 106.05,11.43 108.59,13.97 109.86,13.97 110.49,14.61 110.49,17.78 111.13,17.78 SV1.5
X2
  Bottom 0.254: D50.1 101.6,12.7 102.87,13.97 105.41,13.97 107.95,16.51 107.95,19.05 109.86,19.05 111.13,20.32 SV1.7
X3
  Bottom 0.254: D54.1 100.97,15.24 100.97,13.34 100.33,13.34 100.33,6.35 107.32,6.35 113.03,12.06 113.03,22.23 111.76,22.23 SV1.9
X4
  Bottom 0.254: D58.1 101.6,17.78 102.87,19.05 106.05,19.05 108.59,21.59 109.86,21.59 110.49,22.23 110.49,23.5 111.76,24.77 SV1.11
X5
  Bottom 0.254: D62.1 101.6,20.32 102.87,21.59 106.05,21.59 108.59,24.13 109.86,24.13 110.49,24.77 110.49,26.04 111.76,27.3 SV1.13
X6
  Bottom 0.254: D66.1 101.6,25.4 102.87,26.67 109.86,26.67 110.49,27.3 110.49,30.48 111.13,30.48 SV1.15
X7  (via drill 0.61)
  Top 0.254: v107.32,24.13 107.95,24.77 107.95,28.57 109.22,29.84 SV1.16
  Bottom 0.254: v107.32,24.13 102.87,24.13 101.6,22.86 D70.1